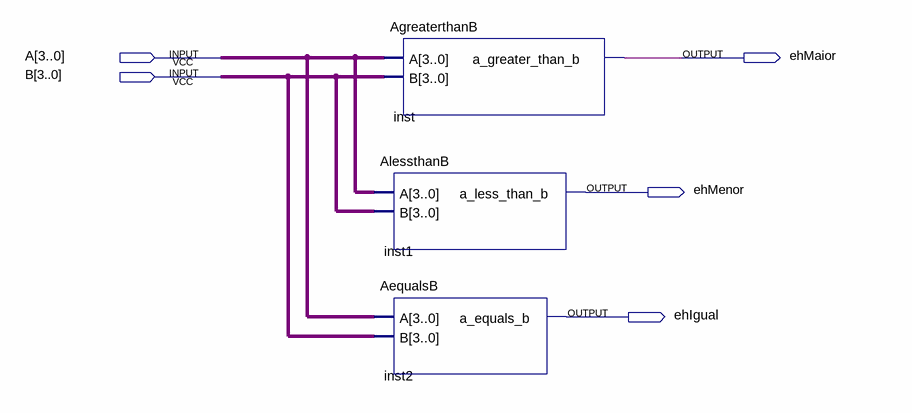
[diagram p0: schematic sheet]
// Quartus schematic magnitudeComparator.bdf as structural Verilog: 3 symbols, 5 pins
module magnitudeComparator (
  input  [3:0] A,
  input  [3:0] B,
  output ehMaior,
  output ehMenor,
  output ehIgual
);

  AgreaterthanB inst (.A(A), .B(B), .a_greater_than_b(ehMaior));
  AlessthanB inst1 (.A(A), .B(B), .a_less_than_b(ehMenor));
  AequalsB inst2 (.A(A), .B(B), .a_equals_b(ehIgual));
endmodule
